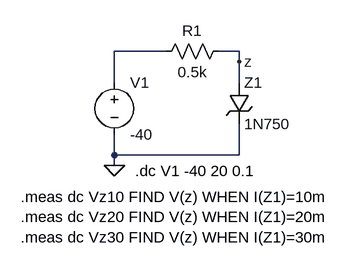
[diagram p0: schematic ej2.1.asc]
ej2.1.asc, the LTspice schematic file:
Version 4.1
SHEET 1 880 680
WIRE 112 64 32 64
WIRE 224 64 192 64
WIRE 224 80 224 64
WIRE 32 112 32 64
WIRE 224 112 224 80
WIRE 32 224 32 192
WIRE 224 224 224 176
WIRE 224 224 32 224
WIRE 32 240 32 224
FLAG 32 240 0
FLAG 224 80 z
SYMBOL voltage 32 96 R0
WINDOW 123 0 0 Left 0
WINDOW 39 0 0 Left 0
SYMATTR InstName V1
SYMATTR Value -40
SYMBOL res 208 48 R90
WINDOW 0 0 56 VBottom 2
WINDOW 3 32 56 VTop 2
SYMATTR InstName R1
SYMATTR Value 0.5k
SYMBOL zener 208 112 R0
SYMATTR InstName Z1
SYMATTR Value 1N750
TEXT 64 248 Left 2 !.dc V1 -40 20 0.1
TEXT -112 288 Left 2 !.meas dc Vz10 FIND V(z) WHEN I(Z1)=10m\n.meas dc Vz20 FIND V(z) WHEN I(Z1)=20m\n.meas dc Vz30 FIND V(z) WHEN I(Z1)=30m

The netlist it stands for:
* ej2.1.asc
V1 N001 0 -40
R1 z N001 0.5k
D§Z1 z 0 1N750
.model D D
.lib standard.dio
.dc V1 -40 20 0.1
.meas dc Vz10 FIND V(z) WHEN I(Z1)=10m
.meas dc Vz20 FIND V(z) WHEN I(Z1)=20m
.meas dc Vz30 FIND V(z) WHEN I(Z1)=30m
.backanno
.end

* Results of the author's LTspice run, read from the files saved beside the schematic
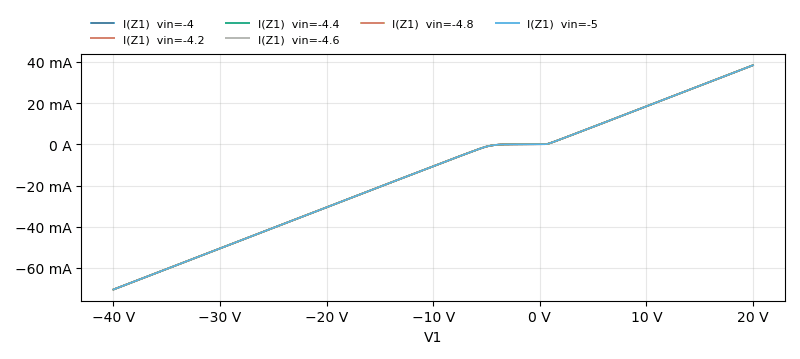
[diagram p1: DC transfer characteristic of ej2.1.asc, plotted from the saved traces]
* DC transfer characteristic, 6 runs:
*   I(Z1) [vin=-4]: -70.46 mA at V1=-40 V, 38.36 mA at V1=20 V, min -70.46 mA, max 38.36 mA
*   I(Z1) [vin=-4.2]: -70.46 mA at V1=-40 V, 38.36 mA at V1=20 V, min -70.46 mA, max 38.36 mA
*   I(Z1) [vin=-4.4]: -70.46 mA at V1=-40 V, 38.36 mA at V1=20 V, min -70.46 mA, max 38.36 mA
*   I(Z1) [vin=-4.6]: -70.46 mA at V1=-40 V, 38.36 mA at V1=20 V, min -70.46 mA, max 38.36 mA
*   I(Z1) [vin=-4.8]: -70.46 mA at V1=-40 V, 38.36 mA at V1=20 V, min -70.46 mA, max 38.36 mA
*   I(Z1) [vin=-5]: -70.46 mA at V1=-40 V, 38.36 mA at V1=20 V, min -70.46 mA, max 38.36 mA
* From the log:
*   Measurement: vz10
*     step  V(z)   at
*        1  0.776071112389  5.776071019
*        2  0.776071112389  5.776071019
*        3  0.776071112389  5.776071019
*        4  0.776071112389  5.776071019
*        5  0.776071112389  5.776071019
*        6  0.776071112389  5.776071019
*   Measurement: vz20
*     step  V(z)   at
*        1  0.797407615758  10.7974075174
*        2  0.797407615758  10.7974075174
*        3  0.797407615758  10.7974075174
*        4  0.797407615758  10.7974075174
*        5  0.797407615758  10.7974075174
*        6  0.797407615758  10.7974075174
*   Measurement: vz30
*     step  V(z)   at
*        1  0.810811651909  15.810811601
*        2  0.810811651909  15.810811601
*        3  0.810811651909  15.810811601
*        4  0.810811651909  15.810811601
*        5  0.810811651909  15.810811601
*        6  0.810811651909  15.810811601